# EasyEDA Pro project CH32V203C8T6采样模块.eprj, schematic 主拓展板原理图
Board Name: 主拓展板; Create Date: 2025-09-29; Page Name: 原理图; Project Name: CH32V203C8T6采样模块; Schematic Name: 主拓展板原理图; Update Date: 2025-10-08; Company: 嘉立创EDA; Page Size: A4; Version: V1.0
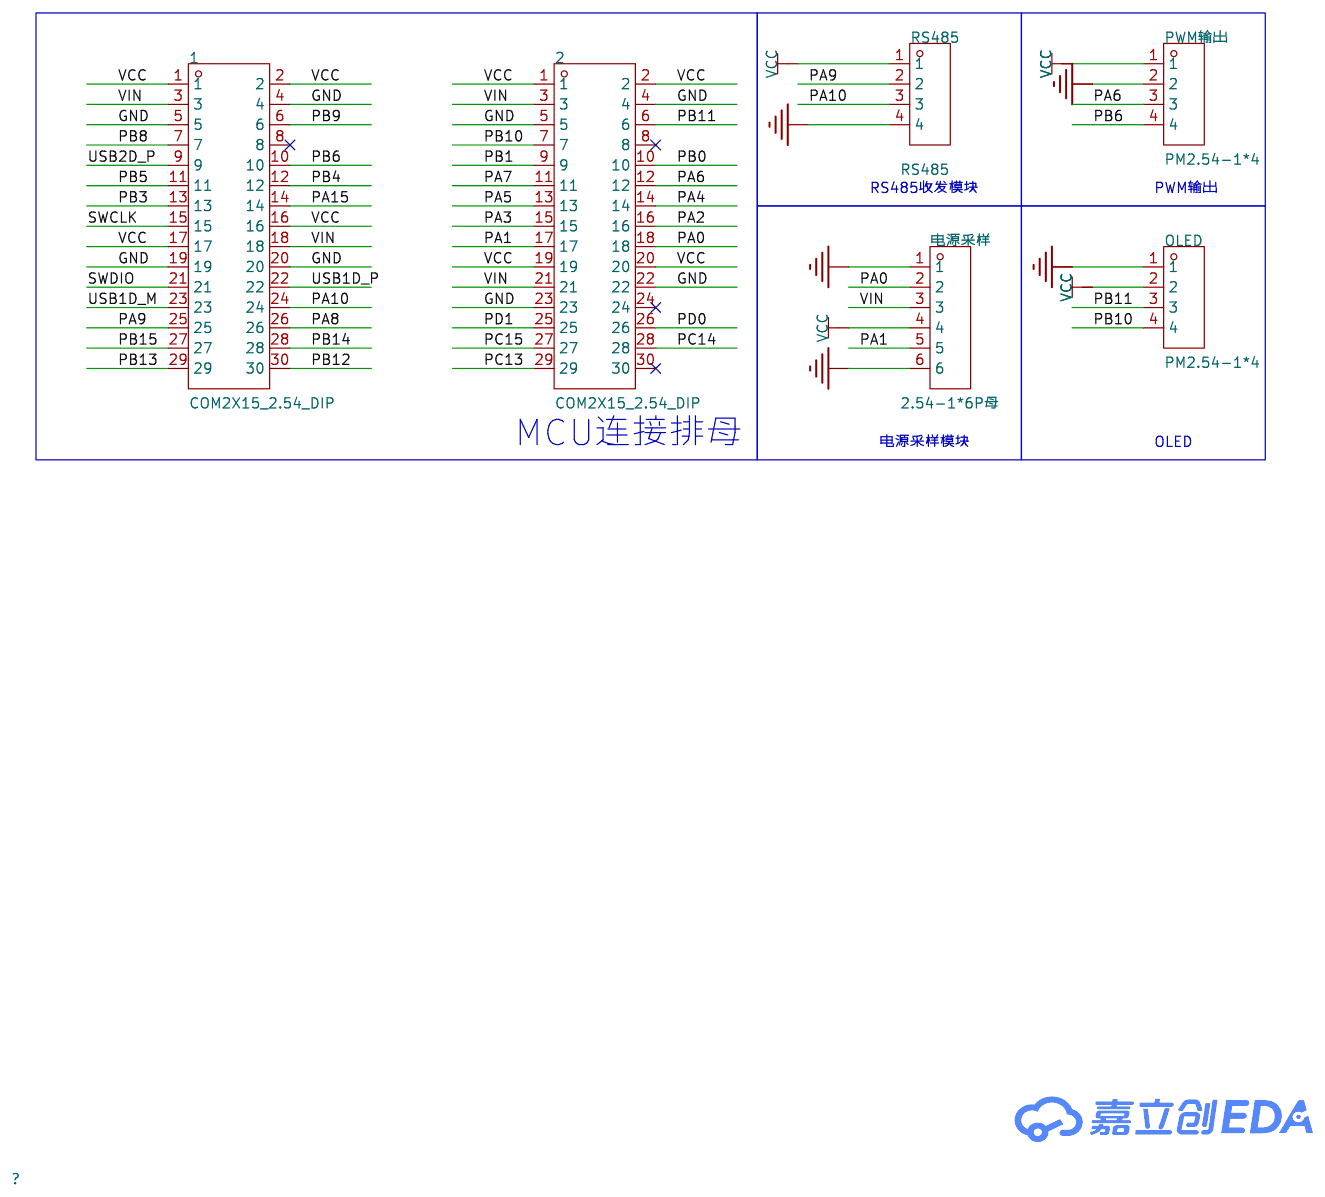
[diagram p0: schematic sheet]

## Parts
1  COM2X15_2.54_DIP  [HDR-TH_30P-P2.54-V-M-R2-C15-S2.54]
2  COM2X15_2.54_DIP  [HDR-TH_30P-P2.54-V-M-R2-C15-S2.54]
OLED  PM2.54-1*4  [HDR-TH_4P-P2.54-V-F]
PWM输出  PM2.54-1*4  [HDR-TH_4P-P2.54-V-F]
RS485  RS485  [HDR-TH_4P-P2.54-V-F]
电源采样  2.54-1*6P母  [HDR-TH_6P-P2.54-V-F]

## Library data of the parts
1 2 = COM2X15_2.54_DIP: Supplier Part: C9900027096; Supplier Footprint: 2X15PIN2.54排针; JLCPCB Part Class: 扩展库; Supplier: LCSC
OLED PWM输出 = PM2.54-1*4: LCSC Part Name: 间距:2.54mm 1x4P 直插; Supplier Part: C5116530; Manufacturer: ZHOURI(洲日); Supplier Footprint: 插件,P=2.54mm; JLCPCB Part Class: 扩展库; Datasheet: https://item.szlcsc.com/datasheet/PM2.54-1*4/5692947.html; Supplier: LCSC; Holes Structure: 1x4P; Pitch: 2.54mm; Row Spacing: 2.54mm; Circular Hole / Square Hole: 方孔; Mounting Type: 直插; Number of Rows: 单排; Number of Positions: 4P; Current Rating: 2.5A; Holes Direction: 顶部; Insulation Height: 8.5mm; Operating Temperature: -40℃~+105℃
RS485 = 2.54-1*4P母: LCSC Part Name: 间距:2.54mm 1x4P 直插; Supplier Part: C2718488; Manufacturer: BOOMELE(博穆精密); Supplier Footprint: 插件,P=2.54mm; JLCPCB Part Class: 扩展库; Datasheet: https://item.szlcsc.com/datasheet/2.54-1*4P%25E6%25AF%258D/2834502.html; Supplier: LCSC; Holes Structure: 1x4P; Pitch: 2.54mm; Circular Hole / Square Hole: 方孔; Mounting Type: 直插; Number of Rows: 单排; Number of Positions: 4P; Current Rating: 3A; Holes Direction: 顶部; Contact Material: 青铜; Operating Temperature: -40℃~+105℃
电源采样 = 2.54-1*6P母: LCSC Part Name: 间距:2.54mm 1x6P 直插; Supplier Part: C40877; Manufacturer: BOOMELE(博穆精密); Supplier Footprint: 插件,P=2.54mm; JLCPCB Part Class: 扩展库; Datasheet: https://item.szlcsc.com/datasheet/2.54-1*6P%25E6%25AF%258D/41861.html; Supplier: LCSC; Holes Structure: 1x6P; Pitch: 2.54mm; Mounting Type: 直插; Number of Rows: 单排; Number of Positions: 6P

## Nets
GND: 1.4 1.5 1.19 1.20 2.4 2.5 2.22 2.23 OLED.1 PWM输出.2 RS485.4 电源采样.1 电源采样.6
VCC: 1.1 1.2 1.16 1.17 2.1 2.2 2.19 2.20 OLED.2 PWM输出.1 RS485.1 电源采样.4
VIN: 1.3 1.18 2.3 2.21 电源采样.3
PA0: 2.18 电源采样.2
PA1: 2.17 电源采样.5
PA2: 2.16
PA3: 2.15
PA4: 2.14
PA5: 2.13
PA6: 2.12 PWM输出.3
PA7: 2.11
PA8: 1.26
PA9: 1.25 RS485.2
PA10: 1.24 RS485.3
PA15: 1.14
PB0: 2.10
PB1: 2.9
PB3: 1.13
PB4: 1.12
PB5: 1.11
PB6: 1.10 PWM输出.4
PB8: 1.7
PB9: 1.6
PB10: 2.7 OLED.4
PB11: 2.6 OLED.3
PB12: 1.30
PB13: 1.29
PB14: 1.28
PB15: 1.27
PC13: 2.29
PC14: 2.28
PC15: 2.27
PD0: 2.26
PD1: 2.25
SWCLK: 1.15
SWDIO: 1.21
USB1D_M: 1.23
USB1D_P: 1.22
USB2D_P: 1.9

Not connected (* = marked no-connect by the designer): 1 8*; 2 8* 24* 30*

## Notes on the sheet
- RS485收发模块
- PWM输出
- MCU连接排母
- 电源采样模块
- OLED
